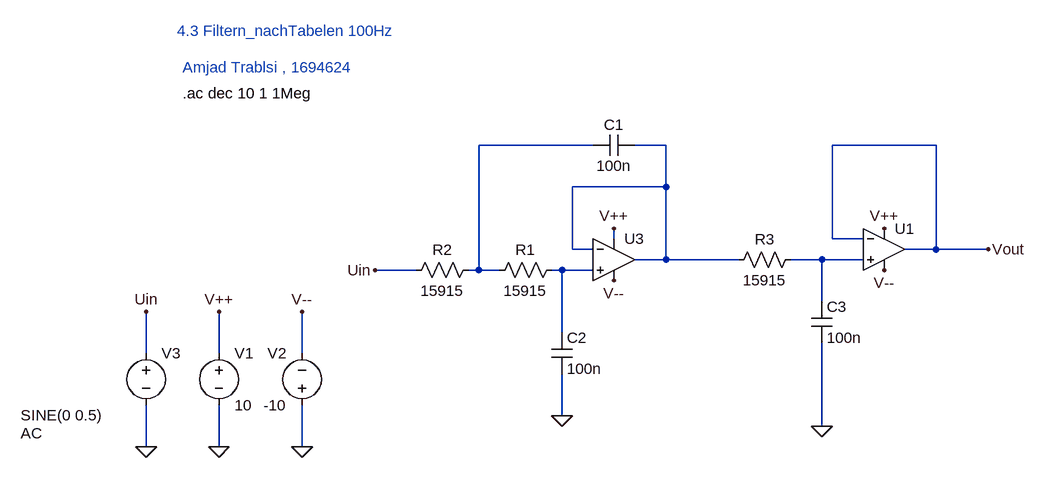
[diagram p0: schematic 4_3_Filtern_nachTabelen.asc]
4_3_Filtern_nachTabelen.asc, the LTspice schematic file:
Version 4
SHEET 1 1432 680
WIRE 752 32 576 32
WIRE 864 32 816 32
WIRE 1280 32 1120 32
WIRE 864 96 864 32
WIRE 864 96 720 96
WIRE 784 176 784 160
WIRE 1120 176 1120 32
WIRE 1168 176 1120 176
WIRE 720 192 720 96
WIRE 752 192 720 192
WIRE 1280 192 1280 32
WIRE 1280 192 1232 192
WIRE 1360 192 1280 192
WIRE 864 208 864 96
WIRE 864 208 816 208
WIRE 976 208 864 208
WIRE 1104 208 1056 208
WIRE 1168 208 1104 208
WIRE 480 224 416 224
WIRE 576 224 576 32
WIRE 576 224 560 224
WIRE 608 224 576 224
WIRE 704 224 688 224
WIRE 752 224 704 224
WIRE 1104 272 1104 208
WIRE 704 320 704 224
WIRE 64 352 64 288
WIRE 176 352 176 288
WIRE 304 352 304 288
WIRE 704 448 704 384
WIRE 1104 464 1104 336
WIRE 64 496 64 432
WIRE 176 496 176 432
WIRE 304 496 304 432
FLAG 704 448 0
FLAG 176 496 0
FLAG 176 288 V++
FLAG 784 160 V++
FLAG 304 496 0
FLAG 304 288 V--
FLAG 784 240 V--
FLAG 64 496 0
FLAG 64 288 Uin
FLAG 416 224 Uin
FLAG 1104 464 0
FLAG 1200 160 V++
FLAG 1200 224 V--
FLAG 1360 192 Vout
SYMBOL voltage 176 336 R0
WINDOW 123 0 0 Left 0
WINDOW 39 0 0 Left 0
SYMATTR InstName V1
SYMATTR Value 10
SYMBOL voltage 304 448 R180
WINDOW 0 24 96 Left 2
WINDOW 3 24 16 Left 2
WINDOW 123 0 0 Left 0
WINDOW 39 0 0 Left 0
SYMATTR InstName V2
SYMATTR Value -10
SYMBOL voltage 64 336 R0
WINDOW 3 -193 111 Left 2
WINDOW 123 -193 139 Left 2
WINDOW 39 0 0 Left 0
SYMATTR Value SINE(0 0.5)
SYMATTR Value2 AC
SYMATTR InstName V3
SYMBOL cap 816 16 R90
WINDOW 0 0 32 VBottom 2
WINDOW 3 32 32 VTop 2
SYMATTR InstName C1
SYMATTR Value 100n
SYMBOL res 704 208 R90
WINDOW 0 0 56 VBottom 2
WINDOW 3 32 56 VTop 2
SYMATTR InstName R1
SYMATTR Value 15915
SYMBOL res 576 208 R90
WINDOW 0 0 56 VBottom 2
WINDOW 3 32 56 VTop 2
SYMATTR InstName R2
SYMATTR Value 15915
SYMBOL cap 688 320 R0
SYMATTR InstName C2
SYMATTR Value 100n
SYMBOL res 1072 192 R90
WINDOW 0 0 56 VBottom 2
WINDOW 3 32 56 VTop 2
SYMATTR InstName R3
SYMATTR Value 15915
SYMBOL cap 1088 272 R0
SYMATTR InstName C3
SYMATTR Value 100n
SYMBOL OpAmps/UniversalOpAmp 784 208 R0
SYMATTR InstName U3
SYMBOL OpAmps/UniversalOpAmp 1200 192 R0
SYMATTR InstName U1
TEXT 112 -144 Left 2 ;4.3 Filtern_nachTabelen 100Hz
TEXT 120 -48 Left 2 !.ac dec 10 1 1Meg
TEXT 120 -88 Left 2 ;Amjad Trablsi , 1694624

The netlist it stands for:
* 4_3_Filtern_nachTabelen.asc
V1 V++ 0 10
V2 0 V-- -10
V3 Uin 0 SINE(0 0.5) AC
C1 N002 N001 100n
R1 N004 N001 15915
R2 N001 Uin 15915
C2 N004 0 100n
R3 N003 N002 15915
C3 N003 0 100n
XU3 N004 N002 V++ V-- N002 level1 Avol=1Meg GBW=10Meg Vos=0 En=0 Enk=0 In=0 Ink=0 Rin=500Meg  ; pins In+ In- V+ V- OUT
XU1 N003 Vout V++ V-- Vout level1 Avol=1Meg GBW=10Meg Vos=0 En=0 Enk=0 In=0 Ink=0 Rin=500Meg  ; pins In+ In- V+ V- OUT
* 4.3 Filtern_nachTabelen 100Hz
.ac dec 10 1 1Meg
* Amjad Trablsi , 1694624
.lib UniversalOpAmp1.lib
.backanno
.end